# EAGLE design 457_I2S_Stereo_Sound_Rev020000beta (EAGLE 9.6.2)
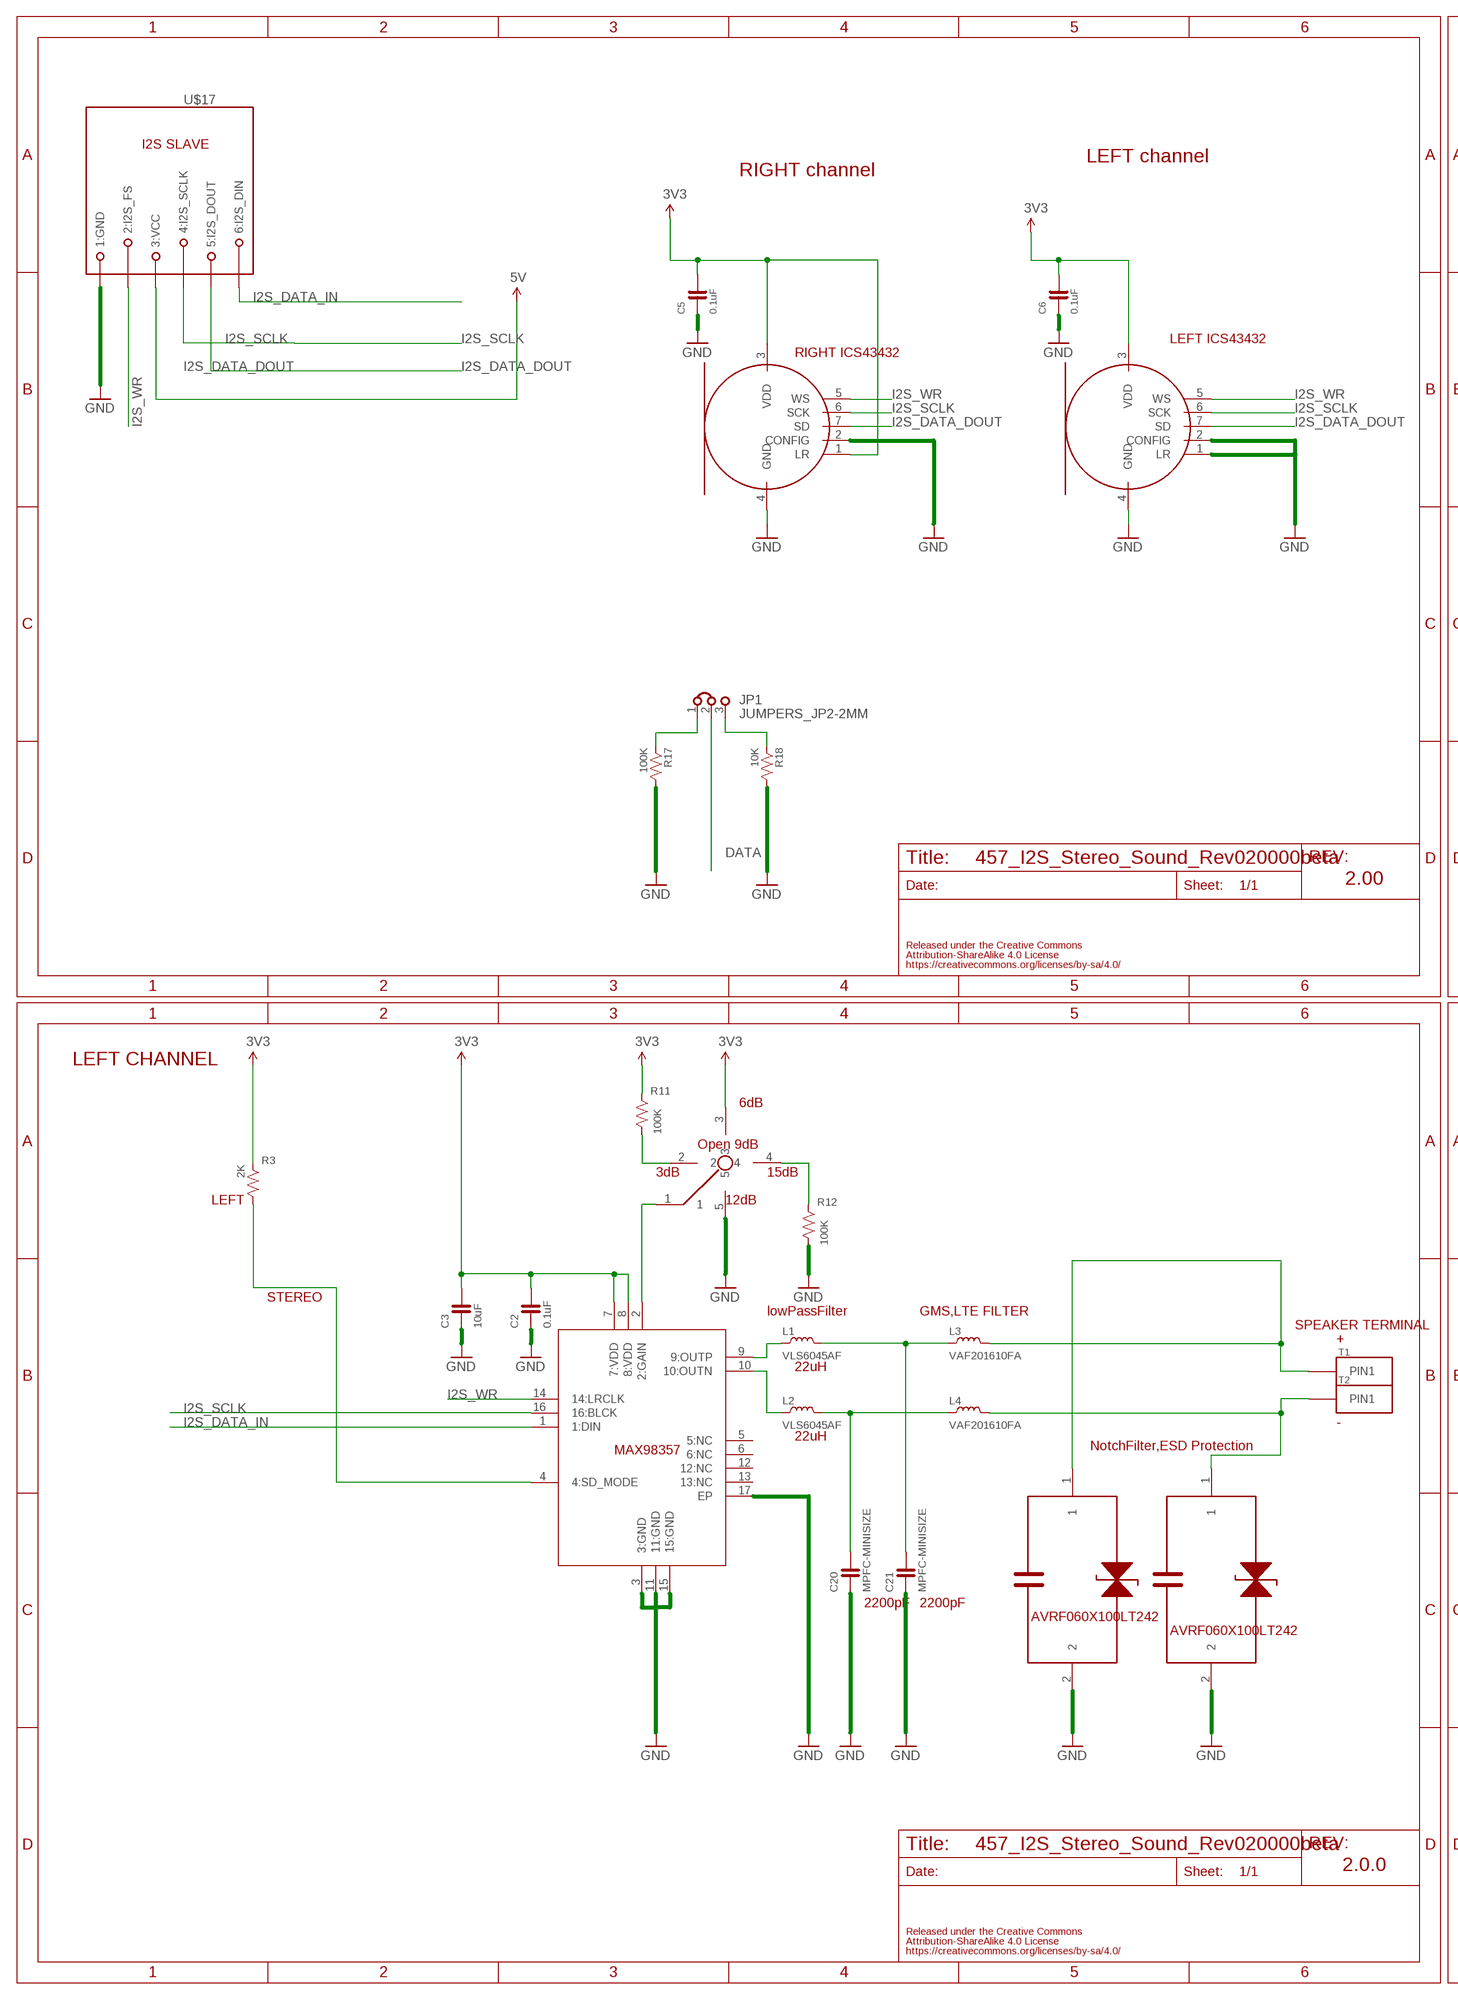
[diagram p0: schematic, sheet 1, part 1 of 2]
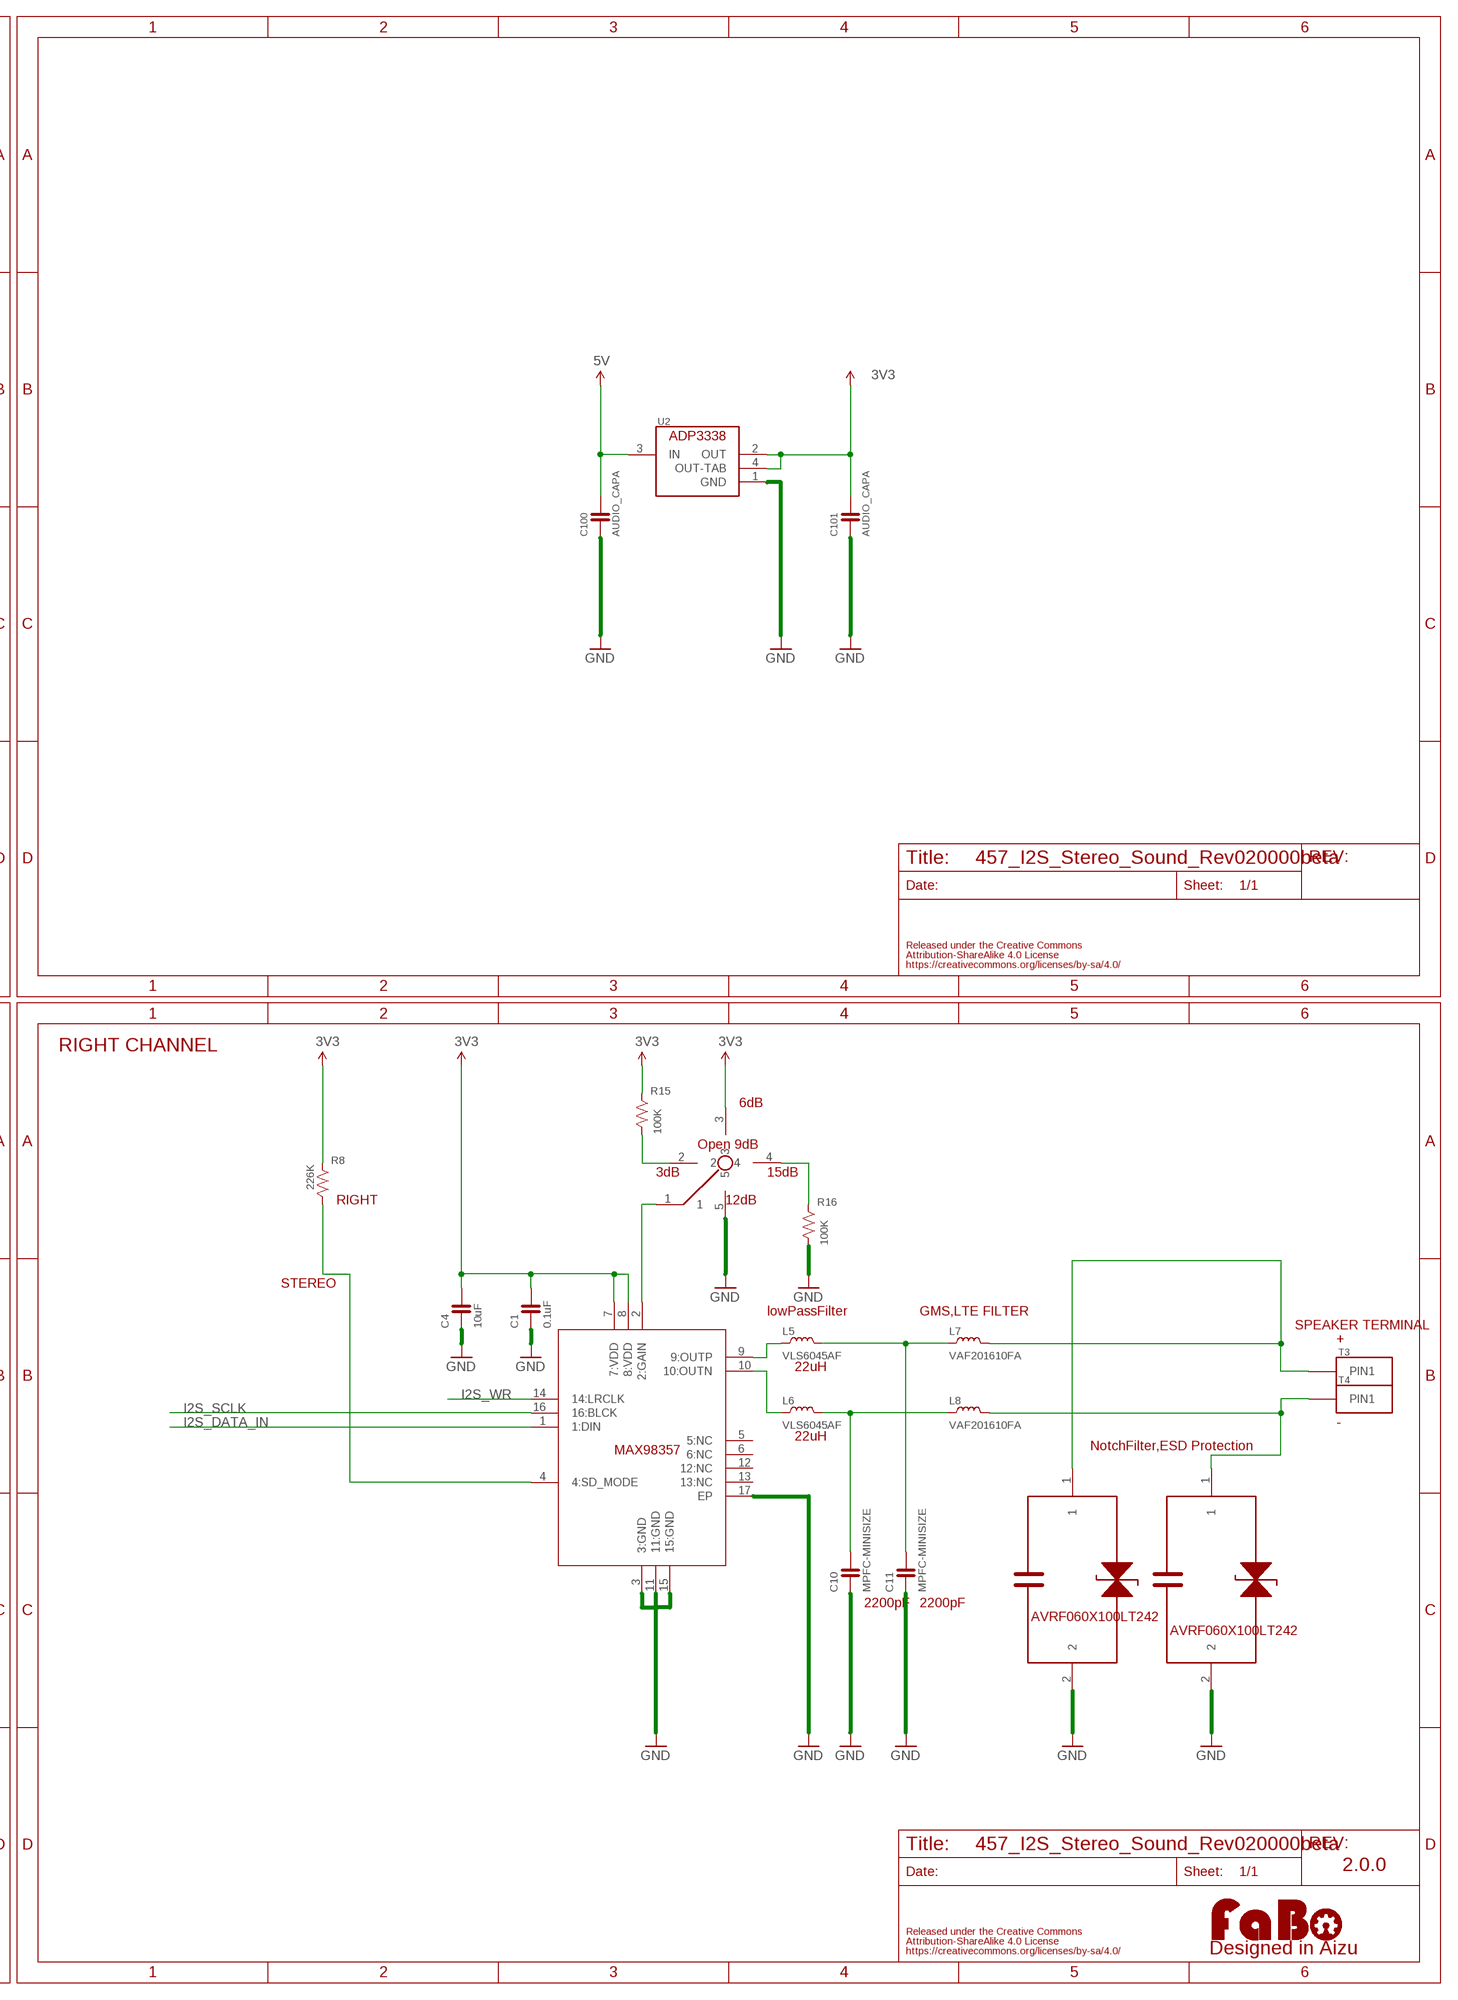
[diagram p1: schematic, sheet 1, part 2 of 2]

## Parts
C1  0.1uF  CAPACITOR-0603  [0603]
C2  0.1uF  CAPACITOR-0603  [0603]
C3  10uF  CAPACITOR-0603  [0603]
C4  10uF  CAPACITOR-0603  [0603]
C5  0.1uF  CAPACITOR-0402  [0402]
C6  0.1uF  CAPACITOR-0402  [0402]
C10  MPFC-MINISIZE  [DIP-MPFC]
C11  MPFC-MINISIZE  [DIP-MPFC]
C20  MPFC-MINISIZE  [DIP-MPFC]
C21  MPFC-MINISIZE  [DIP-MPFC]
C100  AUDIO_CAPA  [3216]
C101  AUDIO_CAPA  [3216]
JP1  JUMPERS_JP2-2MM  [JUMPERS_JP2-2MM]
L1  VLS6045AF  [VLS6045AF]
L2  VLS6045AF  [VLS6045AF]
L3  VAF201610FA  [VAF201610FA-1]
L4  VAF201610FA  [VAF201610FA-1]
L5  VLS6045AF  [VLS6045AF]
L6  VLS6045AF  [VLS6045AF]
L7  VAF201610FA  [VAF201610FA-1]
L8  VAF201610FA  [VAF201610FA-1]
LEFTAMP  MAX98357A,B  [TQFN(16L3*3*0.75)]
LOGO1  LOGO_FABO-M  [LOGO_FABO_M]
MIC_LEFT  TDK-ICS43432  [TDK-ICS43432]
MIC_RIGHT  TDK-ICS43432  [TDK-ICS43432]
R3  2K  RESISTOR-0603  [0603]
R8  226K  RESISTOR-0603  [0603]
R11  100K  RESISTOR-0603  [0603]
R12  100K  RESISTOR-0603  [0603]
R15  100K  RESISTOR-0603  [0603]
R16  100K  RESISTOR-0603  [0603]
R17  100K  RESISTOR-0603  [0603]
R18  10K  RESISTOR-0603  [0603]
RIGHTAMP  MAX98357A,B  [TQFN(16L3*3*0.75)]
T1  TBL004-508  [TBL004-508]
T2  TBL004-508  [TBL004-508]
T3  TBL004-508  [TBL004-508]
T4  TBL004-508  [TBL004-508]
U2  ADP3338AKCZ  [SOT-223-KC3]
U$5  AVRF060X100LT242  [AVRF0X0X100LT_0603]
U$7  AVRF060X100LT242  [AVRF0X0X100LT_0603]
U$9  AVRF060X100LT242  [AVRF0X0X100LT_0603]
U$11  AVRF060X100LT242  [AVRF0X0X100LT_0603]
U$13  2MMJUMPER_CROSS  [PINHEAD2MM_CROSS]
U$14  2MMJUMPER_CROSS  [PINHEAD2MM_CROSS]
U$17  MODULAR-JACK-6P-RJ11_I2S_SLAVE  [7002-6PXC-X]

## Nets
3DB: R11.2 U$13.2
3DB1: R15.2 U$14.2
3V3: C1.2 C2.2 C3.2 C4.2 C5.2 C6.2 C101.2 LEFTAMP.7(7:VDD) LEFTAMP.8(8:VDD) MIC_LEFT.3(VDD) MIC_RIGHT.1(LR) MIC_RIGHT.3(VDD) R3.1 R8.1 R11.1 R15.1 RIGHTAMP.7(7:VDD) RIGHTAMP.8(8:VDD) U2.2(OUT) U2.4(OUT-TAB) U$13.3 U$14.3
5V: C100.2 U2.3(IN) U$17.3(3:VCC)
15DB: R12.1 U$13.4
15DB1: R16.1 U$14.4
DATA: JP1.2
GAIN: LEFTAMP.2(2:GAIN) U$13.1
GAIN1: RIGHTAMP.2(2:GAIN) U$14.1
GND: C1.1 C2.1 C3.1 C4.1 C5.1 C6.1 C10.1 C11.1 C20.1 C21.1 C100.1 C101.1 LEFTAMP.3(3:GND) LEFTAMP.11(11:GND) LEFTAMP.15(15:GND) LEFTAMP.17(EP) MIC_LEFT.1(LR) MIC_LEFT.2(CONFIG) MIC_LEFT.4(GND) MIC_RIGHT.2(CONFIG) MIC_RIGHT.4(GND) R12.2 R16.2 R17.2 R18.2 RIGHTAMP.3(3:GND) RIGHTAMP.11(11:GND) RIGHTAMP.15(15:GND) RIGHTAMP.17(EP) U2.1(GND) U$5.2 U$7.2 U$9.2 U$11.2 U$13.5 U$14.5 U$17.1(1:GND)
I2S_DATA_DOUT: MIC_LEFT.7(SD) MIC_RIGHT.7(SD) U$17.5(5:I2S_DOUT)
I2S_DATA_IN: LEFTAMP.1(1:DIN) RIGHTAMP.1(1:DIN) U$17.6(6:I2S_DIN)
I2S_SCLK: LEFTAMP.16(16:BLCK) MIC_LEFT.6(SCK) MIC_RIGHT.6(SCK) RIGHTAMP.16(16:BLCK) U$17.4(4:I2S_SCLK)
I2S_WR: LEFTAMP.14(14:LRCLK) MIC_LEFT.5(WS) MIC_RIGHT.5(WS) RIGHTAMP.14(14:LRCLK) U$17.2(2:I2S_FS)
LEFTN: L4.2 T2.P$1(PIN1) T2.P$2(PIN1) U$11.1
LEFTP: L3.2 T1.P$1(PIN1) T1.P$2(PIN1) U$9.1
MS: LEFTAMP.4(4:SD_MODE) R3.2
MS1: R8.2 RIGHTAMP.4(4:SD_MODE)
N$20: JP1.1 R17.1
N$21: JP1.3 R18.1
OPTN2: C20.2 L2.2 L4.1
OUTN: L2.1 LEFTAMP.10(10:OUTN)
OUTP: L1.1 LEFTAMP.9(9:OUTP)
OUTP2: C21.2 L1.2 L3.1
OUTRN: L6.1 RIGHTAMP.10(10:OUTN)
OUTRN2: C10.2 L6.2 L8.1
OUTRP: L5.1 RIGHTAMP.9(9:OUTP)
OUTRP2: C11.2 L5.2 L7.1
RIGHTN: L8.2 T4.P$1(PIN1) T4.P$2(PIN1) U$7.1
RIGHTP: L7.2 T3.P$1(PIN1) T3.P$2(PIN1) U$5.1
Unconnected: LEFTAMP.5(5:NC) LEFTAMP.6(6:NC) LEFTAMP.12(12:NC) LEFTAMP.13(13:NC) RIGHTAMP.5(5:NC) RIGHTAMP.6(6:NC) RIGHTAMP.12(12:NC) RIGHTAMP.13(13:NC)

## Notes on the sheet
- LEFT channel
- RIGHT channel
- LEFT ICS43432
- RIGHT ICS43432
- 2.00
- RIGHT CHANNEL
- LEFT CHANNEL
- 6dB | 6dB
- Open 9dB | Open 9dB
- 3dB | 15dB | 3dB | 15dB
- LEFT | 12dB | RIGHT | 12dB
- STEREO
- STEREO
- lowPassFilter | GMS,LTE FILTER | lowPassFilter | GMS,LTE FILTER
- SPEAKER TERMINAL | SPEAKER TERMINAL
- + | +
- 22uH | 22uH
- - | -
- 22uH | NotchFilter,ESD Protection | 22uH | NotchFilter,ESD Protection
- 2200pF | 2200pF | 2200pF | 2200pF
- AVRF060X100LT242 | AVRF060X100LT242
- AVRF060X100LT242 | AVRF060X100LT242
- 2.0.0 | 2.0.0

## Library data of the parts
C1-C6 = FaBo-Capacitor:CAPACITOR: CAPACITOR
C10 C11 C20 C21 = FaBo-Capacitor:MPFC-MINISIZE
C100 C101 = FaBo-Capacitor:AUDIO_CAPA
JP1 = 52101-101-REV-A_v16:JUMPERS_JP2-: Jumper/Bridge
L1 L2 L5 L6 = FaBo-Coil:VLS6045AF
L3 L4 L7 L8 = FaBo-Coil:VAF201610FA
LEFTAMP RIGHTAMP = FaBo-AudioIC:MAX98357A,B
LOGO1 = component:LOGO_FABO
MIC_LEFT MIC_RIGHT = FaBo-Mems:TDK-ICS43432
R3 R8 R11 R12 R15-R18 = FaBo-Resistors:RESISTOR: RESISTOR
T1-T4 = FaBo-Terminal:TBL004-508
U2 = FaBo-Supply:ADP3338AKCZ
U$5 U$7 U$9 U$11 = FaBo-Coil:AVRF060X100LT242: ESD Notch Filters For wireless audio equipment TDK AVRF series ESD protection and noise protechtion.
U$13 U$14 = FaBo-PIN:2MMJUMPER_CROSS
U$17 = FaBo-Connetor:MODULAR-JACK-6P-RJ11_I2S_SLAVE

## Board
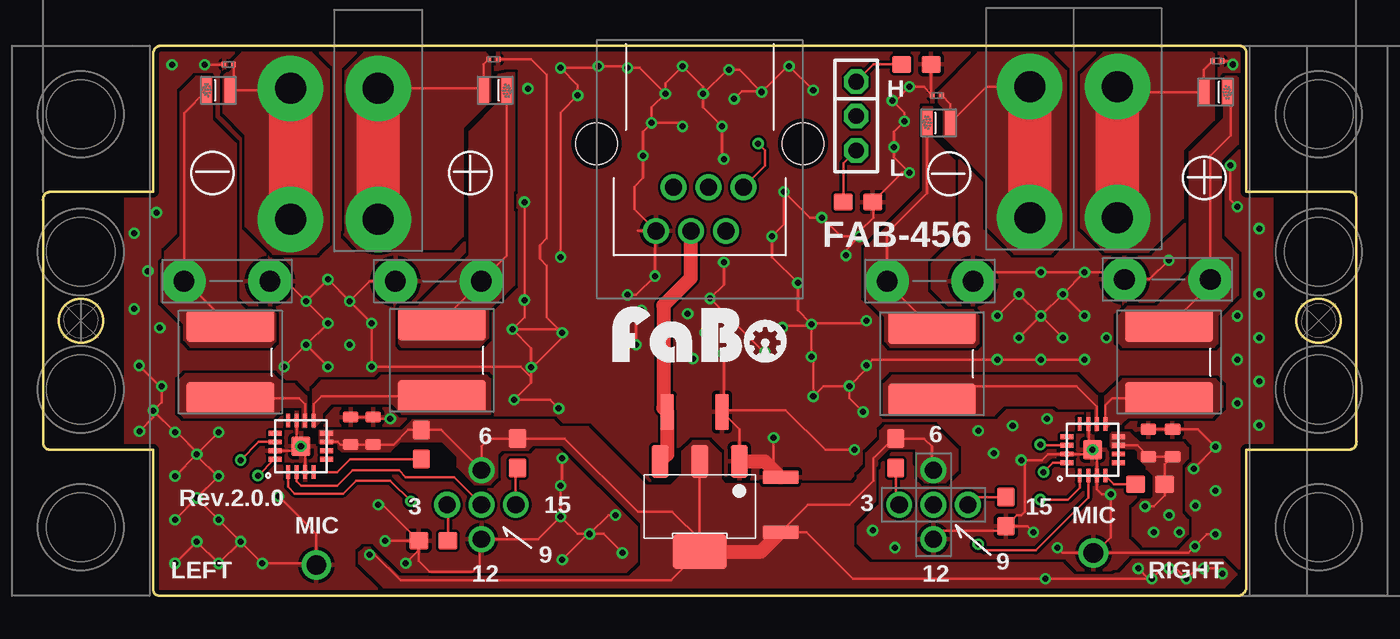
[diagram p2: board, top side]
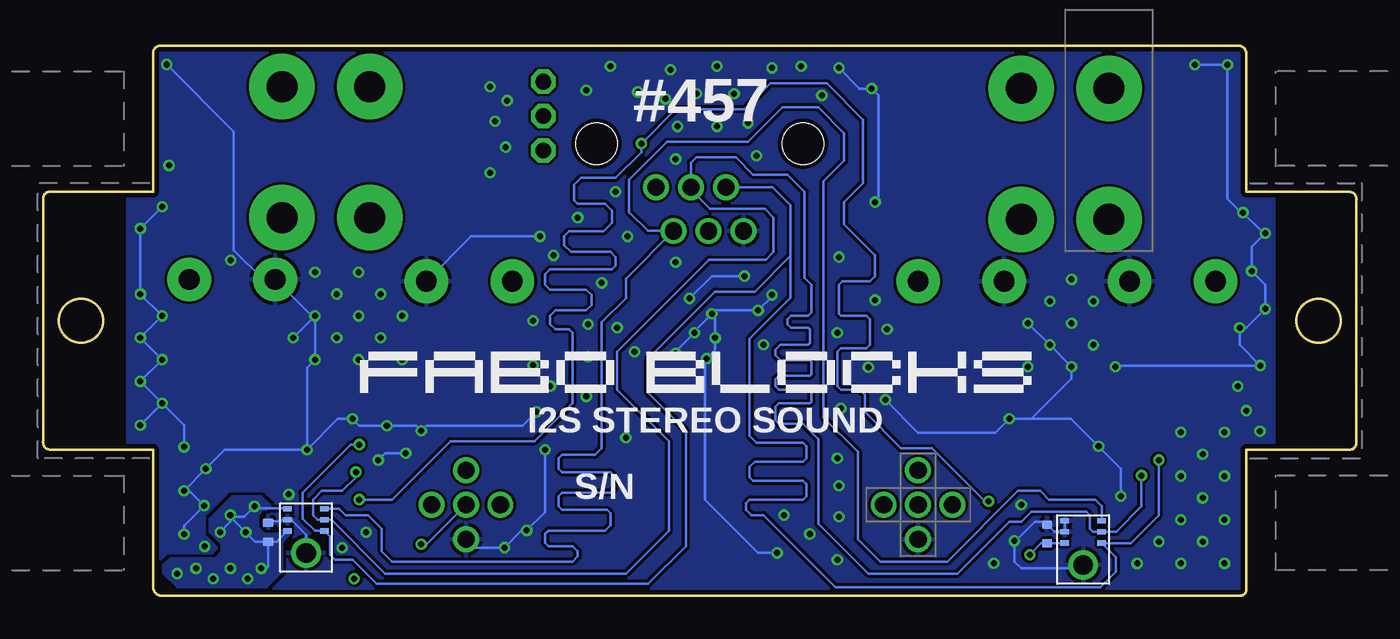
[diagram p3: board, bottom side, seen from below]

Size 76.41 x 32 mm. Coordinates in mm from the lower left corner, seen from the top.
Outline: 6.9,32 69.5,32 arc-90 70,31.6 70,23.5 76,23.5 arc-90 76.4,23.1 76.4,9 arc-90 76,8.5 70,8.5 70,0.5 arc-90 69.4,0 6.8,0 arc-90 6.4,0.4 6.4,8.5 0.4,8.5 arc-90 0,8.9 0,23 arc-90 0.4,23.5 6.4,23.5 6.4,31.5 arc-90 6.9,32
Outline: circle at 74.2,16 radius 1.27
Outline: circle at 2.2,16 radius 1.27
Copper layers (1*16): Top 0.035mm / dielectric 1.6mm / Bottom 0.035mm
Design rules "PCBway": minimum track width 6mil, minimum drill 12mil, track to track 6mil, track to pad 6mil, pad to pad 6mil, via to via 6mil, smd to smd 6mil, copper to edge 10mil, drill to drill 10mil, minimum pad ring 10mil, minimum via ring 6mil, stop-mask expansion 2mil, vias tented up to drill 100mil, thermal gap 8mil
tKeepout: area 64.1,20 to 67.1,34; area 22.1,20.2 to 25.1,34.2
tRestrict: area -1.2,7.3 to 4.7,24.4; area 71.6,7.5 to 77.5,24.6
bRestrict: area -1.2,7.3 to 4.7,24.4; area 71.6,7.6 to 76.5,24.7

### Footprints (pad centres in the part's own frame; a part is rotated, then mirrored left to right if it is on the bottom)
0603 = smd 0.65 x 0.9: 1 -0.8,0; 2 0.8,0
0402 = smd 0.5 x 0.6: 1 -0.55,0; 2 0.55,0
DIP-MPFC = drill 1.2 pad 2.54: 1 -2.5,0; 2 2.5,0
3216 = smd 0.8 x 2.1: 1 -1.6,0; 2 1.6,0
JUMPERS_JP2-2MM = drill 0.914 octagon: 1 -2,0; 2 0,0; 3 2,0
VLS6045AF = smd 1.9 x 5.1: 1 -2.1,0; 2 2.1,0
VAF201610FA-1 = smd 0.65 x 1.6: 1 -0.675,0; 2 0.675,0
TQFN(16L3*3*0.75) = smd 0.28 x 0.8: 1 -0.75,-1.5; 2 -0.25,-1.5; 3 0.25,-1.5; 4 0.75,-1.5; 9 0.75,1.5; 10 0.25,1.5; 11 -0.25,1.5; 12 -0.75,1.5 | smd 0.8 x 0.28: 5 1.5,-0.75; 6 1.5,-0.25; 7 1.5,0.25; 8 1.5,0.75; 13 -1.5,0.75; 14 -1.5,0.25; 15 -1.5,-0.25; 16 -1.5,-0.75 | smd 1.1 x 1.1: 17 0,0
TDK-ICS43432 = smd 0.5 x 0.3: 1 1.075,-2.575; 2 1.075,-1.925; 3 1.075,-1.275; 5 -1.075,-1.275; 6 -1.075,-1.925; 7 -1.075,-2.575 | drill 1.15 pad 1.65: 4 0,0
0603' = smd 1.1 x 1: 1 -0.85,0; 2 0.85,0
TBL004-508 = drill 1.8 pad 3.81: P$1 0,3.81; P$2 0,-3.81
SOT-223-KC3 = smd 1 x 1.9: 1 -2.3,-2.625; 2 0,-2.625; 3 2.3,-2.625 | smd 3.15 x 2: 4 0,2.625
AVRF0X0X100LT_0603 = smd 0.25 x 0.3: 1 -0.275,0; 2 0.275,0
PINHEAD2MM_CROSS = drill 1: 1 0,0; 2 -2,0; 3 0,2; 4 2,0; 5 0,-2
7002-6PXC-X = drill 1: 1 2.55,5.08; 2 1.53,2.54; 3 0.51,5.08; 4 -0.51,2.54; 5 -1.53,5.08; 6 -2.55,2.54 | hole 2.4: -6,0; 6,0

### Placement (x,y rotation side)
C1  17.9,9.6 270 top
C2  64.3,8.9 270 top
C3  65.7,8.9 270 top
C4  19.2,9.6 270 top
C5  18,3.6 270 bottom
C6  63.3,3.7 270 bottom
C10  51.6,18.3 180 top
C11  65.4,18.4 0 top
C20  10.7,18.3 180 top
C21  23,18.3 0 top
C100  37.9,10.7 180 top
C101  42.9,5.3 270 top
JP1  47.3,27.9 270 top
L1  23.2,13.7 90 top
L2  10.9,13.6 90 top
L3  26.3,29.4 180 top
L4  10.2,29.4 0 top
L5  65.5,13.6 90 top
L6  51.7,13.5 90 top
L7  68.2,29.3 180 top
L8  52.1,27.5 0 top
LEFTAMP  15,8.7 0 top
LOGO1  38.2,13.2 0 top
MIC_LEFT  15.9,1.8 180 bottom
MIC_RIGHT  61.1,2.5 180 bottom
R3  2K  [0603']  22,8.8 270 top
R8  226K  [0603']  64.4,6.5 180 top
R11  100K  [0603']  27.6,8.3 270 top
R12  100K  [0603']  22.7,3.2 180 top
R15  100K  [0603']  49.6,8.3 270 top
R16  100K  [0603']  56,4.9 270 top
R17  100K  [0603']  50.8,30.9 0 top
R18  10K  [0603']  47.4,22.9 0 top
RIGHTAMP  61.05,8.5 0 top
T1  19.5,25.7 180 top
T2  14.4,25.7 180 bottom
T3  62.5,25.8 180 top
T4  57.4,25.8 180 top
U2  38.2,5.2 180 top
U$2  [4-1BLOCK]  2.2,16 0 top
U$4  [4-1BLOCK]  74.2,16 180 top
U$5  68.3,31.1 0 top
U$7  52,29.1 180 top
U$9  26.2,31.2 0 top
U$11  10.8,30.9 180 top
U$13  25.5,5.3 0 bottom
U$14  51.8,5.3 0 top
U$17  38.2,26.3 180 top

### Tracks (layer width: path | path; a pad name or v marks a point on that pad's centre or on a via)
3DB
  Top 0.152: U$13.2 27.5,7.35 R11.2
3DB1
  Top 0.152: R15.2 49.6,5.5 U$14.2
3V3  (via drill 0.35)
  Top 0.152: 16.6,8.95 17.15,8.95 17.3,8.8 C1.2 C4.2 20.4,8.8 21.25,9.65 R3.1 23.15,9.65 U$13.3 25.5,8.7 25.95,9.15 R11.1 30.35,9.15 34.6,4.9 36.6,4.9 38.27,3.24 38.27,2.64 U2.4 38.1,2.58 | 16.6,8.95 LEFTAMP.7 | LEFTAMP.8 16.6,9.35 16.6,8.95 | v19,2.4 19.3,2.4 20.8,0.9 36.53,0.9 38.1,2.48 38.1,2.58 | RIGHTAMP.8 RIGHTAMP.7 63.65,8.75 C2.2 C3.2 65.25,7.65 R8.1 65.25,5.85 64.6,5.2 v64.1,5.2 | U$14.3 51.7,7.4 51.7,8.7 51.25,9.15 R15.1 49.55,9.2 49.5,9.2 48.3,8 48.3,6.7 46.9,5.3 44.5,5.3 C101.2 44.4,3.7 47.1,1 v58.3,1 v64.5,1 | U2.2 38.2,2.68 38.1,2.58 | v64.5,1 64.3,1 v63.7,1.6 | v64.5,1 65.1,1.6 v65.5,1.6 65.9,1.6 v66.5,1 67.1,1.6 v67.5,1.6 68.3,1.6 v68.6,1.3
  Top 0.813: U2.4 41.78,2.58 C101.2
  Bottom 0.152: MIC_LEFT.3 17,3.05 C5.2 18.35,3.05 v19,2.4 | C6.2 62.8,3.15 MIC_RIGHT.3 | C6.2 63.3,1.7 63.4,1.6 v63.7,1.6 | C6.2 64.05,3.15 v64.6,3.7 65.5,4.6 | v65.5,4.7 65.5,4.6 | 65.5,4.6 65.5,4.3 v66.1,3.7 | 65.5,4.6 64.7,4.6 v64.1,5.2 64,5.1 62.2,5.1 MIC_RIGHT.1
  pour Top (no thermals): 16.1,8.9 16.1,9.6 20.9,9.6 21.5,10.2 29.7,10.2 30.1,9.8 31.7,9.8 35.1,6.4 36.5,6.4 37.2,7.1 37.2,8.4 37.8,9 38.7,9 39.4,8.3 39.4,6.8 39.7,6.5 47.1,6.5 47.4,6.8 47.4,7 47.9,7.5 47.9,8.3 48.7,9.1 48.7,9.6 49,9.9 51.8,9.9 53.2,8.5 53.2,7.3 52.5,6.6 51.3,6.6 50.9,7 50.9,7.7 50.8,7.8 50.8,8.6 49.2,8.6 48.5,7.9 48.5,7.6 48.4,7.5 48.4,5.5 47.1,4.2 47.1,2.9 48.1,1.9 59.3,1.9 60,1.2 62.3,1.2 62.4,1.3 62.6,1.3 63.4,2.1 68.6,2.1 69.45,1.25 68.7,0.5 19.8,0.5 18.4,1.9 18.4,2.5 18.7,2.8 19,2.8 20.7,1.1 34.1,1.1 34.8,1.8 34.8,4.2 30.2,8.8 28.5,8.8 28.2,8.5 26.7,8.5 26.4,8.2 26.4,6.9 26,6.5 25.1,6.5 24.1,7.5 24.1,8.1 23.2,9 20.8,9 20.2,8.4 17.4,8.4 17.2,8.6 17.2,8.8 17.1,8.9
  pour Top (no thermals): 63.4,3.5 63.4,5.1 63.9,5.6 64.4,5.6 64.6,5.8 64.6,7 64.2,7.4 64.2,7.5 63.7,8 63.7,8.4 63.5,8.6 62.2,8.6 62.1,8.7 62.1,9.4 62.2,9.5 63.2,9.5 63.8,8.9 66.3,8.9 66.6,8.6 66.6,8 66.2,7.6 66.2,4.8 66.6,4.4 66.6,3.6 65.9,2.9 64,2.9
  pour Bottom (no thermals): 68.6,0.5 69.4,1.3 69.4,1.8 69,2.2 66.4,2.2 66,2.6 66,3 66.7,3.7 66.7,4.5 65.4,5.8 63.7,5.8 63.2,5.3 63.2,5.2 63.4,5 63.6,5 63.9,4.7 63.9,4 63.5,3.6 62.7,3.6 62.5,3.8 62.2,3.8 62.1,3.7 62.1,3.5 62.5,3.1 62.5,1.4 63.4,0.5
5V
  Top 0.813: U$17.3 37.69,18.49 36.09,16.89 36.09,10.92 C100.2 36.3,8.23 U2.3
15DB
  Top 0.152: U$13.4 23.55,5.25 R12.1
15DB1
  Top 0.152: R16.1 54.25,5.75 U$14.4
GAIN
  Top 0.152: LEFTAMP.2 14.75,6.66 15,6.41 17.11,6.41 18,7.3 20.7,7.3 21.1,6.9 23.9,6.9 U$13.1
GAIN1  (via drill 0.35)
  Top 0.152: RIGHTAMP.2 60.8,5.7 57.75,2.65 54.75,2.65 v54.4,3
  Bottom 0.152: v54.4,3 54.1,3 U$14.1
GND  (via drill 0.35)
  Top 0.152: C1.1 C4.1 19.3,10.3 v20.2,10.3 | v19.9,3.2 R12.2 | LEFTAMP.3 15.25,8.15 15.3,8.2 15.3,8.4 15.15,8.55 | 15.15,8.55 LEFTAMP.17 | LEFTAMP.15 14.8,8.45 | 14.8,8.45 15.05,8.45 15.15,8.55 | LEFTAMP.11 14.75,8.5 14.8,8.45 | R12.2 21.85,2.05 22.5,1.4 25,1.4 25.4,1.8 25.4,3.2 U$13.5 28.8,3.3 v30.1,4.6 | U$9.2 28.4,31.2 29.3,30.3 29.3,20.8 28.9,20.4 28.9,19.6 29.3,19.2 29.3,16.2 v30.2,15.3 30.2,15.2 | U$17.1 34.62,21.22 | v13.7,5.8 15.9,3.6 15.9,1.9 | 15.9,1.9 MIC_LEFT.4 | C2.1 C3.1 67.16,9.7 v68.2,8.66 v66.93,7.39 | 60.83,8.28 60.8,8.25 RIGHTAMP.15 58.45,8.25 58.1,7.9 v56.9,7.9 57.1,7.7 57.1,4.9 56.9,4.7 56.65,4.7 R16.2 | 60.83,8.28 RIGHTAMP.17 61.3,8.25 RIGHTAMP.3 61.3,6.2 61.6,5.9 v62.1,5.9 62.1,3.4 61.2,2.5 | RIGHTAMP.11 60.83,9.98 60.83,8.28 | R16.2 55.75,3.8 52.3,3.8 U$14.5 | U$5.2 69,31.1 v69.2,30.9 | U$7.2 51.65,29.18 | 51.65,29.18 R17.2 | 46.9,12.05 v46.9,12.2 | v47.2,8.5 45.5,8.5 43.2,10.8 39.6,10.8 | v47.5,20.9 47.5,21.2 48.3,22 48.3,22.85 R18.2 49.95,24.6 v50.4,24.6 49.5,25.5 v49.5,26.1 49.5,27 v50.1,27.6 50.1,28.1 v49.4,28.8 49.6,28.8 v50.4,29.6 51.23,29.6 51.65,29.18 | U$17.1 35.6,21.17 v35.6,18.6 34.5,17.5 v34,17.5 | v42,14.2 41.9,14.2 v38.8,17.3 39.6,18.1 v39.6,19.4 | R12.2 21.85,2.65 v21.1,1.9 | R12.2 19.75,5.3 v19.5,5.3 | v30.1,4.6 31.1,3.6 31.7,3.6 | 31.7,3.6 v31.8,3.6 | v31.8,3.6 32.6,3.6 v33.7,2.5 | v30.2,2.1 31.7,3.6 | v35.4,27.5 34.9,27 v34.9,25.6 34.9,24.3 34.4,23.8 34.4,22.47 U$17.1 | v35.4,27.5 35.4,28.4 v36.2,29.2 | C10.1 54.62,18.82 v58.04,18.82 v60.58,18.82 | v60.58,18.82 62.28,18.82 62.8,18.3 C11.1 64.36,18.4 v65.48,19.52 | C20.1 14.13,18.3 v15.3,17.13 15.34,17.17
  Top 0.152: 15.34,17.17 v16.57,18.4 v17.84,17.13 | v17.84,17.13 19.01,18.3 C21.1 | v17.84,17.13 v19.11,15.86 v19.11,13.32 27.78,13.32 28.4,12.7 | v27.3,15.5 28.4,14.4 v28.4,13.3 28.4,13.2 | 28.4,13.2 28.4,12.7 | 28.4,12.7 28.4,12.4 v27.4,11.4 29.5,11.4 v30,10.9 | v46.9,12.2 45.4,12.2 v44.8,11.6 44.8,13.8 v44.7,13.9 44.7,15.7 | v39.6,25.4 39.5,25.5 v39.5,27.3 38.4,28.4 v38.4,29.2 | v37.2,27.3 37,27.5 v35.4,27.5 | v36.2,29.2 36.2,29.8 v37.2,30.8 38.4,29.6 v38.4,29.2 | v38.4,29.2 39.8,30.6 v39.9,30.6 40.5,30.6 v41.8,29.3 41.85,29.35 | 41.85,29.35 43.3,30.8 v43.4,30.8 v44.8,29.4 | 61.2,2.5 MIC_RIGHT.4 59.3,2.5 v59,2.8 | 61.2,2.5 66.62,2.5 v67,2.88 67.7,3.58 v68.2,3.58 | R16.2 57.25,4.05 v57.6,3.7 | v46.9,12.2 47.9,13.2 v47.9,13.4 48.24,13.74 v55.5,13.74 v58.04,13.74 v60.58,13.74 | v7.68,1.89 v8.95,3.16 v10.22,1.89 v11.49,3.16 | v11.49,3.16 v12.76,1.89 v12.77,1.9 15.9,1.9 | v11.49,3.16 v10.22,4.43 v8.95,5.7 | v7.68,4.43 v8.95,5.7 | v8.95,5.7 10.18,6.93 | 10.18,6.93 v10.22,6.97 | v7.68,6.97 v8.95,8.24 | v8.95,8.24 8.95,8.15 10.18,6.93 | v8.95,8.24 9.01,8.3 | 9.01,8.3 v10.22,9.51 | 9.01,8.3 7.79,9.51 v7.68,9.51 v6.41,10.78 | v6.41,10.78 6.41,10.38 v5.61,9.58 | v6.41,10.78 6.9,11.27 v6.9,12.19 6.8,12.19 v5.6,13.39 | U$11.2 10.52,30.89 v9.4,30.89 | v69.47,22.63 69.07,23.03 v69.07,25.03 | v47.5,20.9 46.4,20.9 v45.3,22 44.6,22 v43.1,23.5 43.1,21.6 v42.4,20.9 42.4,19.7 v43.9,18.2 43.9,16.6 44.65,15.85 | 44.65,15.85 v44.7,15.8 44.7,15.7 | v47.9,16 47.75,15.85 44.65,15.85 | v46.7,19.8 46.7,20.1 v47.5,20.9 | v47.7,10.7 46.9,11.5 v46.9,12.2 | v55.5,16.28 v56.77,17.55 58.01,16.31 | 58.01,16.31 v58.04,16.28 | v58.04,16.28 v59.31,17.55
  Top 0.152: v59.31,17.55 v60.58,18.82 | v59.31,17.55 v60.58,16.28 | v58.04,16.28 v59.31,15.01 | v56.77,15.01 58.01,16.25 58.01,16.31 | v14.03,13.32 v15.3,14.59 | v15.3,14.59 v16.57,13.32 | v15.3,14.59 v16.57,15.86 15.34,17.1 15.34,17.17 | v36.2,29.2 34.7,30.7 v34,30.7 33.9,30.8 v32.3,30.8 32.2,30.7 v30.1,30.7 31.1,29.7 v31.1,29.1 30.1,28.1 v30.1,19.7 | v28,22.9 v28,17.2 28,16.2 v27.3,15.5 | v30.2,8 30.2,6.5 v30.1,6.4 v30.1,4.6 | v31.8,3.6 32.9,4.7 v33.3,4.7 | v34.5,14.6 34.5,16.3 v34.8,16.6 | 30.2,15.2 30.2,15 28.4,13.2 | v40.2,28.9 40.65,29.35 41.85,29.35 | v43,15.6 43.1,15.7 44.7,15.7 | v27.3,15.5 29.9,15.5 30.2,15.2 | 39.6,10.8 C100.1 40.5,9.7 U2.1 | v39.6,14.1 39.6,10.8 | C101.1 42.5,7.3 v42.5,9.2
  Top 0.813: U2.1 41.98,7.83 C101.1
  Bottom 0.152: v20.2,10.3 16.6,10.3 LEFTAMP.17 13.7,7.4 v13.7,5.8 | MIC_LEFT.4 16.1,1.6 19.5,1.6 19.9,2 v19.9,3.2 19.8,3.2 18.7,4.3 18.15,4.3 C5.1 17.58,3.73 MIC_LEFT.2 MIC_LEFT.1 | v20.2,10.3 21,9.5 25.5,9.5 v27.4,11.4 | v69.2,30.9 65.3,27 65.3,20.1 63.6,18.4 C11.1 60.78,16.28 v60.58,16.28 | v33.7,2.5 34.8,2.5 37.9,5.6 37.9,13.7 v37.8,13.8 37.3,14.3 v37.3,15 37.3,16.2 v37.5,16.4 | C10.1 51.5,20.9 v47.5,20.9 | C6.1 63.2,4.35 62.55,4.35 62.48,4.43 MIC_RIGHT.2 62.15,4.4 61.91,4.4 61.91,4.38 61.1,3.57 MIC_RIGHT.4 | v35.6,18.6 37.5,18.6 v38.8,17.3 | v34,17.5 34,17.4 v34.8,16.6 37.3,16.6 v37.5,16.4 | v37.5,16.4 38.5,15.4 v38.5,15.3 39.6,14.2 v39.6,14.1 | v55.3,8.3 56.5,8.3 v56.9,7.9 | RIGHTAMP.17 59.25,10.3 v58.4,10.3 58,9.9 v56.4,9.9 54.7,9.9 v54.4,9.6 54.1,9.9 48.5,9.9 v47.7,10.7 | v60.58,16.28 v60.58,13.74 61.05,13.27 RIGHTAMP.17 | v61.85,15.01 v60.58,16.28 | v20.2,10.3 18.91,10.3 16.57,12.64 v16.57,13.32 v17.84,14.59 v19.11,15.86 | v47.2,8.5 47.2,4.87 v48.26,3.81 48.56,3.81 v49.56,2.81 51.31,2.81 U$14.5 | RIGHTAMP.17 65.82,8.5 v66.93,7.39 v68.2,6.12 67.9,6.12 v67.03,5.25 68.2,4.08 v68.2,3.58 | v68.2,8.66 68.2,9.93 v69.47,11.2 | v69.47,11.2 v70.74,12.47 v69.47,13.74 v70.74,15.01 v69.47,16.28 v70.74,17.55 v70.74,21.36 v69.47,22.63 | v69.47,11.2 v70.74,9.93 | v14.03,13.32 13.96,13.39 v5.6,13.39 6.8,14.59 v6.8,15.59 6.4,15.59 v5.3,16.69 5.3,18.09 v6.1,18.89 6.1,20.29 v5.3,21.09 5.4,21.09 v6.6,22.29 6.69,22.29 7.5,23.1 v7.5,30.89 v9.4,30.89 | v30.1,30.7 28.9,29.5 v28.2,29.5 27.8,29.1 27.8,23.1 v28,22.9
  other vias: 15,8.7 61.05,8.5
  pour Bottom (rank 6): -5.1,-1.1 79.5,-1.1 79.5,33.4 -5.1,33.4
  pour Top (rank 6): -3.2,-1.7 80.3,-1.7 80.3,34.3 -3.2,34.3
I2S_DATA_DOUT
  Bottom 0.152: U$17.5 41.22,21.22 42.3,22.3 42.3,24.2 40.1,26.4 35.4,26.4 33.4,28.4 31.3,28.4 29.81,26.91 29.81,25.3 31,24.1 31,10.37 29,8.37 29,3.3 27.7,2 23.8,2 19.7,6.1 18.4,6.1 17.9,5.6 15.2,5.6 14.83,5.23 MIC_LEFT.7 | MIC_RIGHT.7 59.18,5.08 58.8,4.7 57.5,4.7 56.7,3.9 56.7,2.6 56.1,2 45.6,2 45.3,2.3 45.3,2.6 45.6,2.9 47,2.9 47.2,3.1 47.2,3.6 47,3.8 43.7,3.8 43.4,4.1 43.4,4.8 43.6,5 46.2,5 46.4,5.2 46.4,5.8 46.2,6 43.4,6 43.2,6.2 43.2,7 43.4,7.2 46.2,7.2 46.4,7.4 46.4,8 46.2,8.2 44.3,8.2 43.9,8.6 43.9,15.9 42.5,17.3 42.5,18.45 U$17.5 | 39.88,21.22 U$17.5
I2S_DATA_IN  (via drill 0.35)
  Top 0.152: LEFTAMP.1 14.25,6.35 14.65,5.95 17.45,5.95 18.2,6.7 20.2,6.7 v21.4,5.5 | v41.6,26.3 42,25.9 42,25.01 U$17.6 | RIGHTAMP.1 60.3,6.3 59.6,5.6 v58,5.6
  Bottom 0.152: v21.4,5.5 21.6,5.5 24.7,8.6 26.5,8.6 28.6,10.7 28.6,11.7 28.9,12 30,12 30.2,12.2 30.2,14.2 30,14.4 28.5,14.4 28.3,14.6 28.3,16.1 28.5,16.3 30,16.3 30.1,16.4 30.1,18.1 29.9,18.3 28.3,18.3 28,18.6 28,19.8 29.8,21.6 29.8,22.9 28.7,24 28.7,27.7 30.8,29.8 34.1,29.8 35.6,28.3 39.6,28.3 v41.6,26.3 41.6,25.8 43.1,24.3 45.1,24.3 45.5,23.9 45.5,23 45.3,22.8 43.7,22.8 43.3,22.4 43.3,21.7 43.8,21.2 45.8,21.2 46.1,20.9 46.1,20.4 45.7,20 43.4,20 43.1,19.7 43.1,19.2 43.3,19 46.9,19 47.2,18.7 47.2,18.1 46.9,17.8 44.8,17.8 44.5,17.5 44.5,16.9 44.8,16.6 46.6,16.6 46.9,16.3 46.9,15.8 46.6,15.5 45.8,15.5 45.6,15.3 45.6,11.2 47.8,9 52.7,9 56.1,5.6 v58,5.6
I2S_SCLK  (via drill 0.35)
  Top 0.152: v12.5,7 13.45,7.95 LEFTAMP.16 | v58.2,7.2 58.75,7.75 RIGHTAMP.16
  Bottom 0.152: v12.5,7 12.5,5.2 13.98,3.73 MIC_LEFT.6 15.33,3.73 15.5,3.9 15.5,4.7 15.7,4.9 18.9,4.9 19.5,4.3 20.2,4.3 23.2,1.3 28.4,1.3 31.3,4.2 31.3,9.1 32.2,10 33.6,10 33.8,10.2 33.8,11 33.6,11.2 31.8,11.2 31.7,11.3 31.7,11.9 31.8,12 33.6,12 33.8,12.2 33.8,12.6 33.6,12.8 31.8,12.8 31.7,12.9 31.7,13.6 31.8,13.7 33.5,13.7 33.8,14 33.8,14.3 33.5,14.6 31.9,14.6 31.8,14.7 31.8,15.5 31.9,15.6 32.9,15.6 33.1,15.8 33.1,16.1 32.9,16.3 31.9,16.3 31.7,16.5 31.7,18.1 32.1,18.5 32.1,23.5 33.1,24.5 35.1,24.5 36.1,25.5 38.4,25.5 38.71,25.19 U$17.4 38.71,23.61 37.6,22.5 34.4,22.5 33.9,22 33.9,20 34.35,19.55 37.65,19.55 43,14.2 43,12 40,9 40,3.8 42.5,1.3 56.5,1.3 59.63,4.43 MIC_RIGHT.6 60.43,4.43 60.7,4.7 60.7,5.6 60.2,6.1 59,6.1 58.2,6.9 v58.2,7.2
I2S_WR  (via drill 0.35)
  Top 0.152: v11.5,7.9 12.55,8.95 LEFTAMP.14 | RIGHTAMP.14 58.05,8.75 v58,8.8
  Bottom 0.152: U$17.2 33.96,23.76 32.92,22.72 32.92,19.78 | v11.5,7.9 11.5,4.7 13.13,3.08 MIC_LEFT.5 14,2.25 14,1.4 14.9,0.5 30.3,0.5 34.49,4.69 35.19,4.69 35.5,5 35.5,5.4 35.3,5.6 32.2,5.6 32,5.8 32,6.5 32.2,6.7 35.1,6.7 35.3,6.9 35.3,7.5 35,7.8 32.2,7.8 32,8 32,8.7 32.2,8.9 34.9,8.9 35.3,9.3 35.3,14.96 32.92,17.34 32.92,19.78 | v58,8.8 58.5,8.8 61.3,6 61.3,4.5 60.58,3.78 MIC_RIGHT.5 59.7,3.45 59.7,2.4 59.4,2.1 58.4,2.1 57,0.7 41.2,0.7 39,2.9 39,9.6 41.2,11.8 41.2,13.8 37.3,17.7 35,17.7 32.92,19.78
LEFTN
  Top 0.152: U$11.1 11.08,29.6 L4.2 14.29,29.4 T2.P$2
  Top 2.54: T2.P$2 T2.P$1
  pour Top (no thermals): 10.5,28.6 10.5,30.2 10.6,30.3 10.7,30.4 10.8,30.4 11,30.6 11,31 11.6,31.6 15.6,31.6 16.6,30.6 16.6,29.5 16.6,20.6 16,20 15.9,19.9 13.4,19.9 11.8,21.5 11.8,26.8 10.5,28.1
LEFTP
  Top 0.152: T1.P$2 19.6,29.51 25.52,29.51 L3.2 25.63,30.9 U$9.1
  Top 2.54: T1.P$1 19.5,29.41 19.6,29.51
  pour Top (no thermals): 17.6,30.5 18.7,31.6 19.9,31.6 25.7,31.6 26,31.3 26,28.8 24.4,27.2 24.4,20.9 23.7,20.2 18.3,20.2 17.5,21 17.6,21.1
MS
  Top 0.152: R3.2 17.85,7.95 17.1,7.2 LEFTAMP.4
MS1
  Top 0.152: RIGHTAMP.4 62.3,6.5 R8.2
N$20
  Top 0.152: JP1.1 48.3,30.9 R17.1
N$21
  Top 0.152: R18.1 46.55,25.15 JP1.3
OPTN2
  Top 0.152: L2.2 8.3,18.3 C20.2 8.2,28.08 L4.1
  pour Top (no thermals): 8.2,14.9 8.2,15.8 6.9,17.1 6.9,19.3 7.1,19.5 7.1,20 8,20.9 8,29.3 8.9,30.2 9.7,30.2 9.7,28.6 9.8,28.5 9.8,27.7 11.2,26.3 11.2,17.2 11.7,16.7 11.8,16.6 13.3,16.6 13.5,16.4 13.5,14.8 13.2,14.5 13,14.5 8.6,14.5
OUTN
  Top 0.152: LEFTAMP.10 15.25,11.15 14.9,11.5 L2.1
  pour Top (no thermals): 15.1,9.8 15.1,10.9 15,11 14,11 13.4,10.4 8.2,10.4 7.9,10.7 7.9,12.5 8.3,12.9 13.4,12.9 14,12.3 14.6,12.3 15.3,11.6 15.3,9.8
OUTP
  Top 0.152: LEFTAMP.9 15.75,11.15 16.2,11.6 L1.1
  pour Top (no thermals): 15.7,9.8 15.7,12 16.2,12.5 19.4,12.5 19.7,12.8 25.8,12.8 26,12.6 26,10.6 20.9,10.6 20.3,11.2 16.8,11.2 16.2,10.6 16.2,10.2 15.8,9.8
OUTP2
  Top 0.152: L3.1 26.98,19.78 C21.2 23.2,16 L1.2
  pour Top (no thermals): 20.7,14.7 20.7,16.7 20.8,16.8 21.8,16.8 24.8,19.8 24.8,27 26.5,28.7 26.5,30.3 27,30.4 27.4,30.4 27.4,23.6 27.3,23.5 27.3,22.4 27.4,22.3 27.4,18.1 25.9,16.6 25.9,15 25.4,14.5 20.9,14.5
OUTRN
  Top 0.152: RIGHTAMP.10 61.3,11 60.1,12.2 54,12.2 53.1,11.3 51.8,11.3 L6.1
  pour Top (no thermals): 48.9,10.6 48.9,12.3 49.4,12.8 60.1,12.8 61.3,11.6 61.3,9.6 61.2,9.6 61.2,10.9 59.1,10.9 58.9,11.1 55.9,11.1 55.3,10.5 49,10.5
OUTRN2
  Top 0.152: L6.2 49.1,18.2 C10.2 49.1,21.1 51.43,23.43 L8.1
  pour Top (no thermals): 49,14.8 49,16.2 47.8,17.4 47.8,20.2 51.2,23.6 51.2,28.4 51.7,28.4 51.7,26.6 53,25.3 53,21.1 51.4,19.5 51.4,17.7 52.5,16.6 54.1,16.6 54.4,16.3 54.4,14.7 54.2,14.5 49.3,14.5
OUTRP
  Top 0.152: RIGHTAMP.9 61.8,11.1 62.2,11.5 L5.1
  pour Top (no thermals): 61.8,9.7 61.8,11.6 62.8,12.6 68.2,12.6 68.6,12.2 68.6,11 68,10.4 63.1,10.4 62.7,10 62.1,10
OUTRP2
  Top 0.152: L5.2 67.9,18.1 C11.2 67.9,25.6 69.1,26.8 69.1,29.08 L7.1
  pour Top (no thermals): 62.5,14.8 62.5,16.2 63.1,16.8 64.8,16.8 66.7,18.7 66.7,25.8 68.7,27.8 68.7,30.1 68.8,30.2 69.4,30.2 69.5,30.1 69.5,26.3 68.5,25.3 68.5,20.8 69.5,19.8 69.5,17.5 68.3,16.3 68.3,14.7 68.1,14.5 62.8,14.5
RIGHTN
  Top 0.152: U$7.1 52.78,28.6 L8.2 54.89,29.61 T4.P$2
  Top 2.54: T4.P$2 T4.P$1
  pour Top (no thermals): 52.4,26.7 52.4,28.4 52.2,28.6 52.1,28.7 52.1,29.3 54.4,31.6 58,31.6 58.4,31.6 59.5,30.5 59.5,20.8 58.7,20 58.6,19.9 56.5,19.9 54.9,21.5 54.9,24.2
RIGHTP
  Top 0.152: T3.P$2 62.81,29.3 L7.2 67.53,30.6 U$5.1
  Top 2.54: T3.P$2 T3.P$1
  pour Top (no thermals): 60.4,30 60.4,30.3 61.7,31.6 68,31.6 68.1,31.5 68.1,31 68.1,27.7 66.3,25.9 66.3,22 64.3,20 61.8,20 60.4,21.4

### Text on the board
tPlace: H | L | FAB-456 | 6 | 6 | Rev.2.0.0 | 3 | 15 | 3 | 15 | MIC | MIC | 9 | 9 | LEFT | 12 | 12 | RIGHT
bPlace: #457 | I2S STEREO SOUND | S/N
Document: #457 I2S STEREO SOUND FaBo BLOCKS Rev2.0.0 / 2022/08/10